# Altium schematic sheet v1.5 MCU.SchDoc
size A4; DocumentNumber: 3; SheetNumber: 3
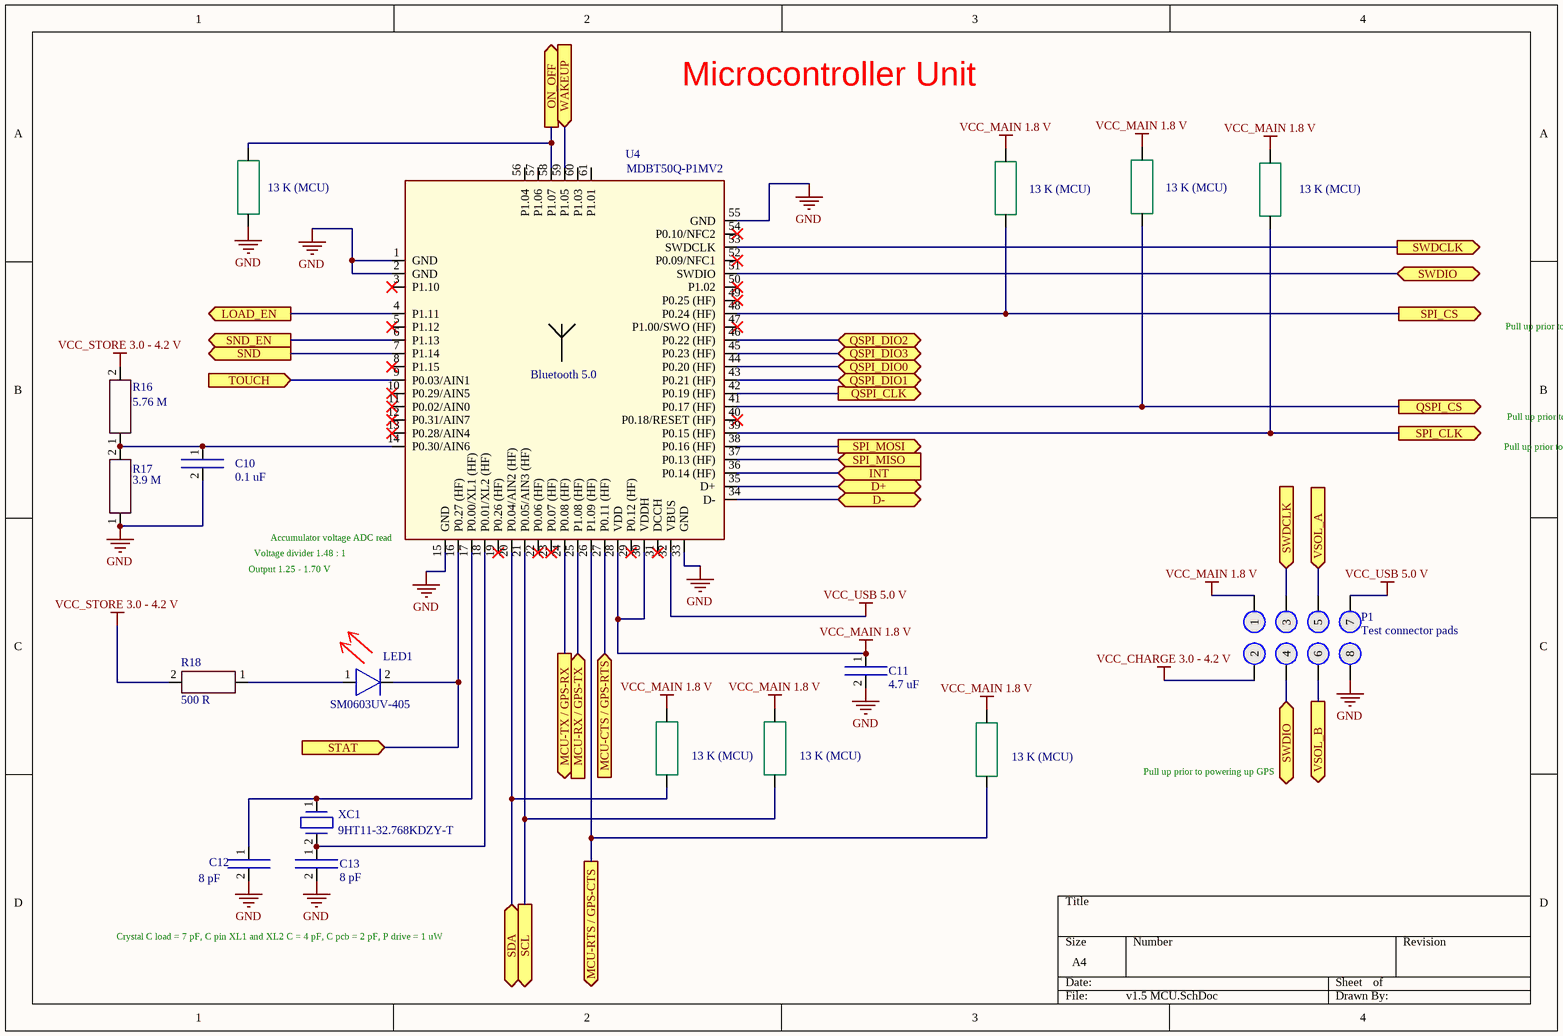
[diagram p0: v1.5 MCU.SchDoc]

## Parts
C10  0.1 uF  [0402]
C11  4.7 uF  [0402]
C12  8 pF  [0402]
C13  8 pF  [0402]
LED1  SM0603UV-405  [0603 - LED1]  (no BOM)
MCU_pull-up/down_1  13 K (MCU)  (graphical)
MCU_pull-up/down_2  13 K (MCU)  (graphical)
MCU_pull-up/down_3  13 K (MCU)  (graphical)
MCU_pull-up/down_5  13 K (MCU)  (graphical)
MCU_pull-up/down_6  13 K (MCU)  (graphical)
MCU_pull-up/down_7  13 K (MCU)  (graphical)
MCU_pull-up/down_?  13 K (MCU)  (graphical)
P1  Test сonnector pads  [Test Connector]  (no BOM)
R16  5.76 M  [0402]
R17  3.9 M  [0402]
R18  500 R  [0402]
U4  MDBT50Q-P1MV2  [MDBT50Q-P1M]
XC1  9HT11-32.768KDZY-T  [9HT11]

## Ports
D+ (bidir), D- (bidir), INT (in), LOAD_EN (out), MCU-CTS / GPS-RTS (in), MCU-RTS / GPS-CTS (out), MCU-RX / GPS-TX (in), MCU-TX / GPS-RX (out), ON_OFF (out), QSPI_CLK (out), QSPI_CS (out), QSPI_DIO0 (bidir), QSPI_DIO1 (bidir), QSPI_DIO2 (bidir), QSPI_DIO3 (bidir), SCL (out), SDA (bidir), SND (out), SND_EN (out), SPI_CLK (out), SPI_CS (out), SPI_MISO (in), SPI_MOSI (out), STAT (in), SWDCLK (in), SWDCLK (out), SWDIO (bidir), TOUCH (in), VSOL_A (in), VSOL_B (out), WAKEUP (in)

## Nets
GND: C10.2 C11.2 C12.2 C13.2 P1.8 R17.1 U4.1(GND) U4.2(GND) U4.15(GND) U4.33(GND) U4.55(GND)
VCC_CHARGE 3.0 - 4.2 V: P1.2
VCC_MAIN 1.8 V: C11.1 P1.1 U4.28(VDD) U4.30(VDDH)
VCC_STORE 3.0 - 4.2 V: R16.2 R18.2
VCC_USB 5.0 V: P1.7 U4.32(VBUS)
D+: U4.35(D+) ; port D+
D-: U4.34(D-) ; port D-
INT: U4.36(P0.14_(HF)) ; port INT
LOAD_EN: U4.4(P1.11) ; port LOAD_EN
MCU-CTS / GPS-RTS: U4.27(P0.11_(HF)) ; port MCU-CTS / GPS-RTS
MCU-RTS / GPS-CTS: U4.26(P1.09_(HF)) ; port MCU-RTS / GPS-CTS
MCU-RX / GPS-TX: U4.25(P1.08_(HF)) ; port MCU-RX / GPS-TX
MCU-TX / GPS-RX: U4.24(P0.08_(HF)) ; port MCU-TX / GPS-RX
ON_OFF: U4.58(P1.07) ; port ON_OFF
QSPI_CLK: U4.42(P0.19_(HF)) ; port QSPI_CLK
QSPI_CS: U4.41(P0.17_(HF)) ; port QSPI_CS
QSPI_DIO0: U4.44(P0.20_(HF)) ; port QSPI_DIO0
QSPI_DIO1: U4.43(P0.21_(HF)) ; port QSPI_DIO1
QSPI_DIO2: U4.46(P0.22_(HF)) ; port QSPI_DIO2
QSPI_DIO3: U4.45(P0.23_(HF)) ; port QSPI_DIO3
SCL: U4.21(P0.05/AIN3_(HF)) ; port SCL
SDA: U4.20(P0.04/AIN2_(HF)) ; port SDA
SND: U4.7(P1.14) ; port SND
SND_EN: U4.6(P1.13) ; port SND_EN
SPI_CLK: U4.39(P0.15_(HF)) ; port SPI_CLK
SPI_CS: U4.48(P0.24_(HF)) ; port SPI_CS
SPI_MISO: U4.37(P0.13_(HF)) ; port SPI_MISO
SPI_MOSI: U4.38(P0.16_(HF)) ; port SPI_MOSI
STAT: LED1.2 U4.16(P0.27_(HF)) ; port STAT
SWDCLK: P1.3 U4.53(SWDCLK) ; port SWDCLK
SWDIO: P1.4 U4.51(SWDIO) ; port SWDIO
TOUCH: U4.9(P0.03/AIN1) ; port TOUCH
VSOL_A: P1.5 ; port VSOL_A
VSOL_B: P1.6 ; port VSOL_B
WAKEUP: U4.59(P1.05) ; port WAKEUP
NetC10_1: C10.1 R16.1 R17.2 U4.14(P0.30/AIN6)
NetC12_1: C12.1 U4.17(P0.00/XL1_(HF)) XC1.1
NetC13_1: C13.1 U4.18(P0.01/XL2_(HF)) XC1.2
NetLED1_1: LED1.1 R18.1

Not connected (* = marked no-connect by the designer): U4 3(P1.10)* 5(P1.12)* 8(P1.15)* 10(P0.29/AIN5)* 11(P0.02/AIN0)* 12(P0.31/AIN7)* 13(P0.28/AIN4)* 19(P0.26_(HF))* 22(P0.06_(HF))* 23(P0.07_(HF))* 29(P0.12_(HF))* 31(DCCH)* 40(P0.18/RESET_(HF))* 47(P1.00/SWO_(HF))* 49(P0.25_(HF))* 50(P1.02)* 52(P0.09/NFC1)* 54(P0.10/NFC2)* 56(P1.04) 57(P1.06) 60(P1.03) 61(P1.01)

## Notes on the sheet
- Microcontroller Unit
- Pull up prior to powering up IMU
- Pull up prior to powering up FLASH
- Output 1.25 - 1.70 V
- (near R17) Voltage divider 1.48 : 1
- (near R17) Accumulator voltage ADC read
- Pull up prior to powering up GPS
- Crystal C load = 7 pF, C pin XL1 and XL2 C = 4 pF, C pcb = 2 pF, P drive = 1 uW
- Labels drawn without touching a wire or pin: GND, VCC_MAIN 1.8 V
- (in symbol MDBT50Q) Bluetooth 5.0

## Library data of the parts
C10-C13 = Capasistor
LED1 = LED
MCU_pull-up/down_1-MCU_pull-up/down_3 MCU_pull-up/down_5-MCU_pull-up/down_7 MCU_pull-up/down_? = Resistor MCU
R16-R18 = Resistor
U4 = MDBT50Q
XC1 = Qartz